# EAGLE design 4ch_relay (EAGLE 9.1.0)
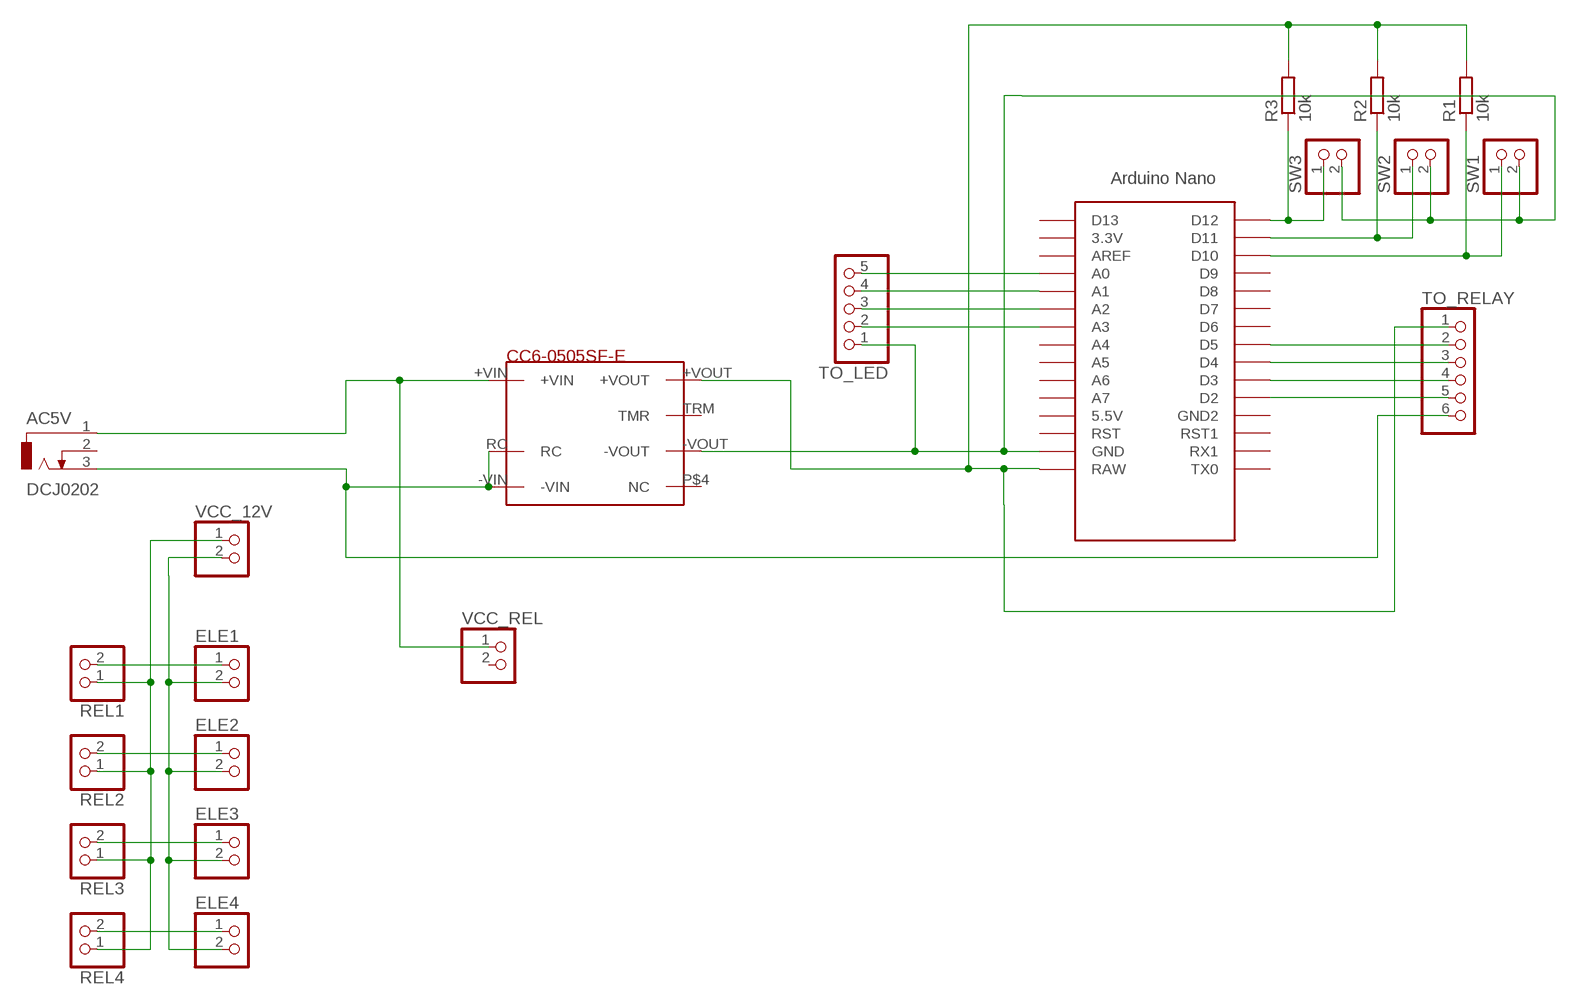
[diagram p0: schematic, sheet 1]

## Parts
AC5V  DCJ0202  [DCJ0202]
DC-DC1  DC-DC-CONVERTER  [DC_DC_CONVERTER]
ELE1  PINHD-1X2  [1X02]
ELE2  PINHD-1X2  [1X02]
ELE3  PINHD-1X2  [1X02]
ELE4  PINHD-1X2  [1X02]
R1  10k  R-EU_0207/10  [0207/10]
R2  10k  R-EU_0207/10  [0207/10]
R3  10k  R-EU_0207/10  [0207/10]
REL1  PINHD-1X2  [1X02]
REL2  PINHD-1X2  [1X02]
REL3  PINHD-1X2  [1X02]
REL4  PINHD-1X2  [1X02]
SW1  PINHD-1X2  [1X02]
SW2  PINHD-1X2  [1X02]
SW3  PINHD-1X2  [1X02]
TO_LED  PINHD-1X5  [1X05]
TO_RELAY  PINHD-1X6  [1X06]
U$1  NANO  [NANO]
VCC_12V  PINHD-1X2  [1X02]
VCC_REL  PINHD-1X2  [1X02]

## Nets
N$1: TO_LED.5 U$1.A0
N$2 [GND]: AC5V.1 DC-DC1.+VIN VCC_REL.1
N$3: TO_LED.4 U$1.A1
N$4: TO_LED.3 U$1.A2
N$5: TO_LED.2 U$1.A3
N$7: R3.1 SW3.1 U$1.D12
N$8: R2.1 SW2.1 U$1.D11
N$9: R1.1 SW1.1 U$1.D10
N$10: TO_RELAY.2 U$1.D5
N$11: TO_RELAY.3 U$1.D4
N$13: TO_RELAY.4 U$1.D3
N$14: TO_RELAY.5 U$1.D2
N$15: DC-DC1.+VOUT R1.2 R2.2 R3.2 TO_RELAY.1 U$1.RAW
N$17 [GND]: DC-DC1.-VOUT SW1.2 SW2.2 SW3.2 TO_LED.1 U$1.GND
N$18 [GND]: ELE1.1 REL1.2
N$19 [GND]: ELE2.1 REL2.2
N$20 [GND]: ELE3.1 REL3.2
N$21 [GND]: ELE4.1 REL4.2
N$23 [GND]: REL1.1 REL2.1 REL3.1 REL4.1 VCC_12V.1
N$25 [GND]: ELE1.2 ELE2.2 ELE3.2 ELE4.2 VCC_12V.2
N$30 [GND]: AC5V.3 DC-DC1.-VIN DC-DC1.RC TO_RELAY.6
Unconnected: AC5V.2 DC-DC1.P$4(NC) DC-DC1.TRM(TMR) U$1.3.3V U$1.5V(5.5V) U$1.A4 U$1.A5 U$1.A6 U$1.A7 U$1.AREF U$1.D6 U$1.D7 U$1.D8 U$1.D9 U$1.D13 U$1.GND1(GND2) U$1.ICSP1 U$1.ICSP2 U$1.ICSP3 U$1.ICSP4 U$1.ICSP5 U$1.ICSP6 U$1.RST U$1.RST1 U$1.RX1 U$1.TX0 VCC_REL.2

## Library data of the parts
AC5V = con-jack:DCJ0202: DC POWER JACK Source: DCJ0202.pdf; OC_FARNELL: unknown; OC_NEWARK: unknown
DC-DC1 = dc-dc-converter_CC6-0505SF-E:DC-DC-CONVERTER: dc-dc-converter CC6-0505SF-E マルツ 5VOUTPUT
ELE1-ELE4 REL1-REL4 SW1-SW3 VCC_12V VCC_REL = pinhead:PINHD-1X2: PIN HEADER
R1-R3 = rcl:R-EU_: RESISTOR, European symbol; SPICEPREFIX: R
TO_LED = pinhead:PINHD-1X5: PIN HEADER
TO_RELAY = pinhead:PINHD-1X6: PIN HEADER
U$1 = Arduino-clone:NANO: Arduino Nano

## Net classes
0 signal: width 0.4 mm, clearance 0.3 mm
1 GND: width 0.6 mm, clearance 0.4 mm

## Board
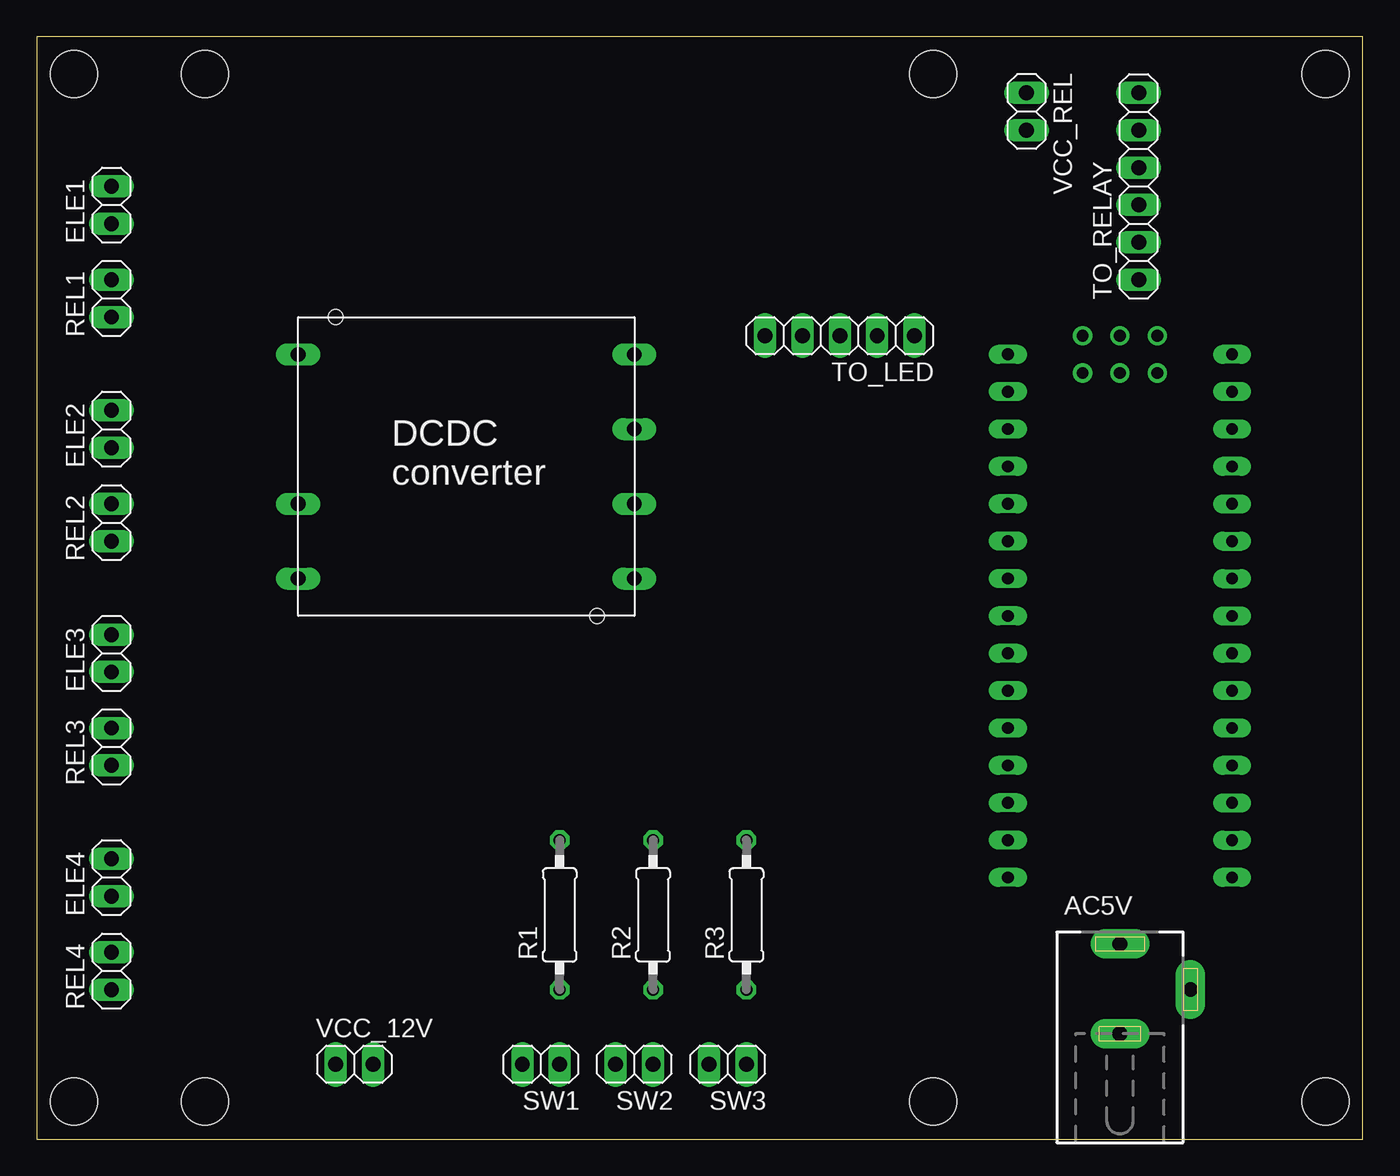
[diagram p1: board, top side]
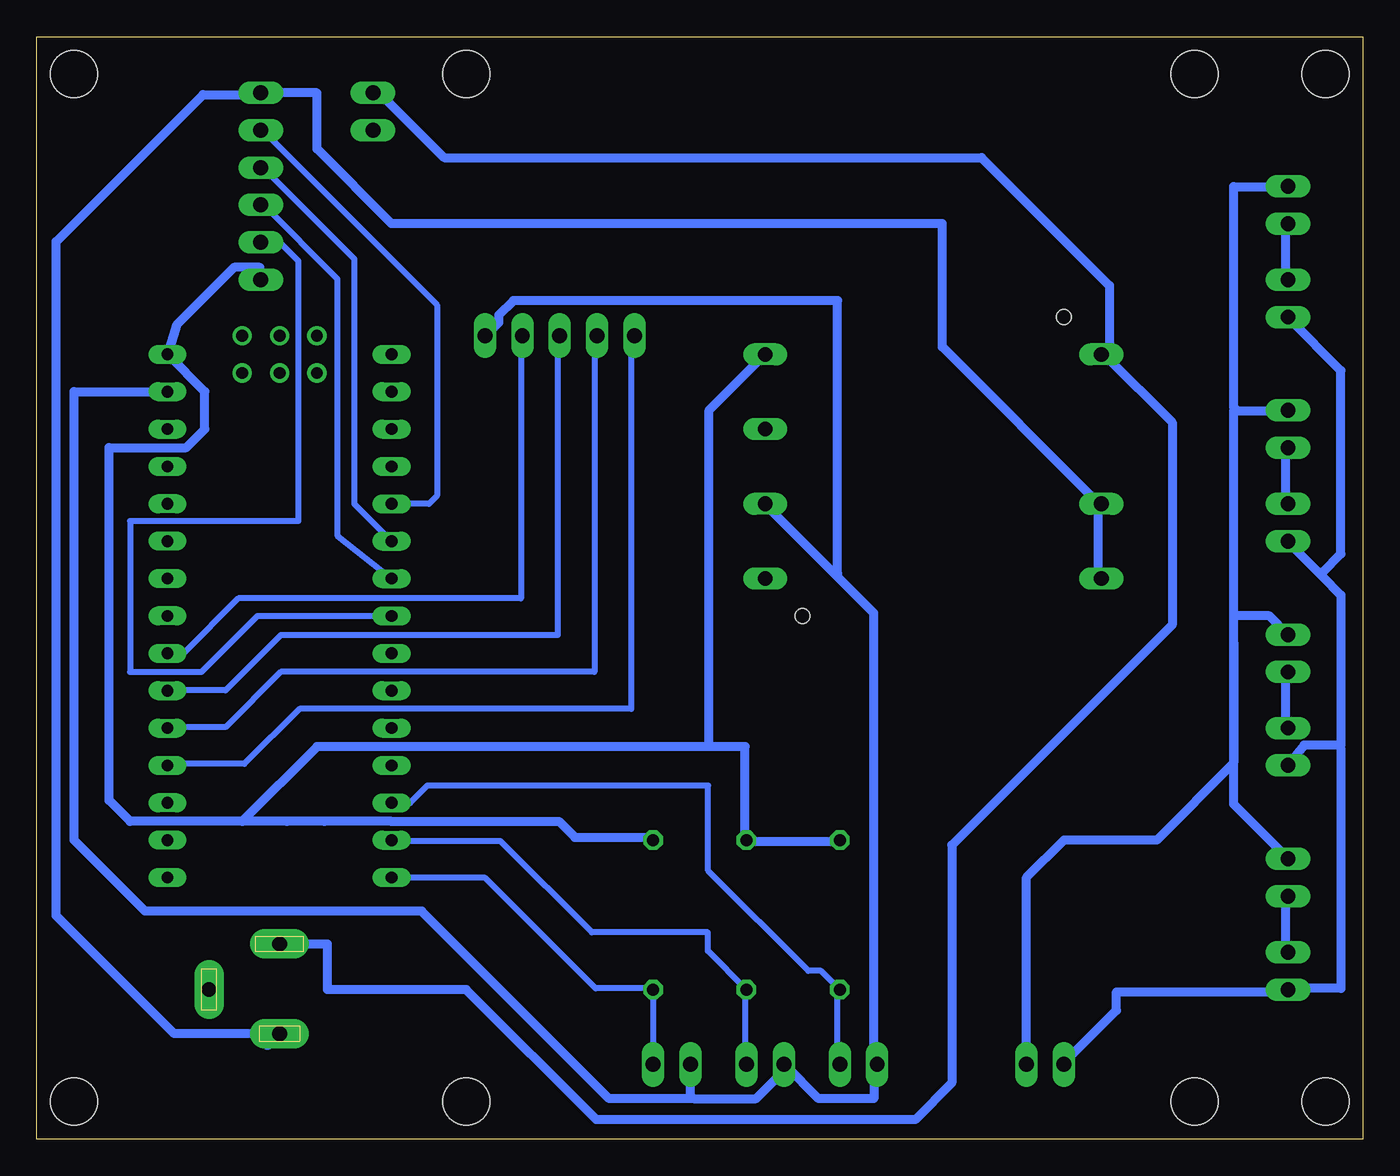
[diagram p2: board, bottom side, seen from below]

Size 90.17 x 74.93 mm. Coordinates in mm from the lower left corner, seen from the top.
Outline: 0,0 90.17,0 90.17,74.93 0,74.92 0,0
Copper layers (1*16): Top 0.035mm / dielectric 1.5mm / Bottom 0.035mm
Design rules "default": minimum track width 6mil, minimum drill 0.35mm, track to track 6mil, track to pad 6mil, pad to pad 6mil, via to via 6mil, smd to smd 6mil, copper to edge 40mil, drill to drill 6mil, minimum pad ring 10mil, minimum via ring 8mil, stop-mask expansion 4mil, vias tented up to drill 0mil, thermal gap 10mil
Holes 3.2 mm at 87.63,72.39 87.63,2.54 2.54,2.54 2.54,72.39 11.43,2.54 60.96,2.54 11.43,72.39 60.96,72.39

### Footprints (pad centres in the part's own frame; a part is rotated, then mirrored left to right if it is on the bottom)
DCJ0202 = drill 1 pad 2 long: 1 0,3.1; 2 4.8,0; 3 0,-3
DC_DC_CONVERTER = drill 1 long: +VIN -11.43,6.35; +VOUT 11.43,6.35; -VIN -11.43,-8.89; -VOUT 11.43,-3.81; P$4 11.43,-8.89; RC -11.43,-3.81; TRM 11.43,1.27 | hole 1: -8.89,8.89; 8.89,-11.43
1X02 = drill 1.016 long: 1 -1.27,0; 2 1.27,0
0207/10 = drill 0.813 octagon: 1 -5.08,0; 2 5.08,0
1X05 = drill 1.016 long: 1 -5.08,0; 2 -2.54,0; 3 0,0; 4 2.54,0; 5 5.08,0
1X06 = drill 1.016 long: 1 -6.35,0; 2 -3.81,0; 3 -1.27,0; 4 1.27,0; 5 3.81,0; 6 6.35,0
NANO = drill 0.8 long: 3.3V -10.16,24.13; 5V -10.16,-1.27; A0 -10.16,19.05; A1 -10.16,16.51; A2 -10.16,13.97; A3 -10.16,11.43; A4 -10.16,8.89; A5 -10.16,6.35; A6 -10.16,3.81; A7 -10.16,1.27; AREF -10.16,21.59; D2 5.08,1.27; D3 5.08,3.81; D4 5.08,6.35; D5 5.08,8.89; D6 5.08,11.43; D7 5.08,13.97; D8 5.08,16.51; D9 5.08,19.05; D10 5.08,21.59; D11 5.08,24.13; D12 5.08,26.67; D13 -10.16,26.67; GND -10.16,-6.35; GND1 5.08,-1.27; RAW -10.16,-8.89; RST -10.16,-3.81; RST1 5.08,-3.81; RX1 5.08,-6.35; TX0 5.08,-8.89 | drill 0.8: ICSP1 -5.08,-10.16; ICSP2 -5.08,-7.62; ICSP3 -2.54,-10.16; ICSP4 -2.54,-7.62; ICSP5 0,-10.16; ICSP6 0,-7.62

### Placement (x,y rotation side)
AC5V  73.66,10.16 0 top
DC-DC1  29.21,46.99 0 top
ELE1  5.08,63.5 90 top
ELE2  5.08,48.26 90 top
ELE3  5.08,33.02 90 top
ELE4  5.08,17.78 90 top
R1  35.56,15.24 90 top
R2  41.91,15.24 90 top
R3  48.26,15.24 90 top
REL1  5.08,57.15 90 top
REL2  5.08,41.91 90 top
REL3  5.08,26.67 90 top
REL4  5.08,11.43 90 top
SW1  34.29,5.08 180 top
SW2  40.64,5.08 180 top
SW3  46.99,5.08 180 top
TO_LED  54.61,54.61 180 top
TO_RELAY  74.93,64.77 90 top
U$1  71.12,44.45 180 top
VCC_12V  21.59,5.08 0 top
VCC_REL  67.31,69.85 270 top

### Tracks (layer width: path | path; a pad name or v marks a point on that pad's centre or on a via)
N$1
  Bottom 0.4: U$1.A0 81.23,25.5 76.06,25.5 72.31,29.25 49.75,29.25 49.75,54.5 TO_LED.5
N$2
  Bottom 0.6: VCC_REL.1 67.25,71 66.75,71 62.46,66.71 25.92,66.71 17.23,58.02 17.23,53.89 DC-DC1.+VIN 17.5,53.25 12.96,48.71 12.96,34.96 27.94,19.98 27.94,3.81 30.43,1.32 52.12,1.32 60.96,10.16 70.4,10.16 70.4,13.25 73.5,13.25 AC5V.1
N$3
  Bottom 0.4: U$1.A1 81.23,28 77.33,28 73.58,31.75 52.25,31.75 52.25,54.5 TO_LED.4
N$4
  Bottom 0.4: U$1.A2 81.23,30.5 77.33,30.5 73.58,34.25 54.75,34.25 54.75,54.5 TO_LED.3
N$5
  Bottom 0.4: TO_LED.2 57.25,54.5 57.25,36.75 76.46,36.75 80.19,33.02 U$1.A3
N$7
  Bottom 0.4: U$1.D12 65.98,17.75 59.67,17.75 52.17,10.25 48.5,10.25 R3.1 48.25,10 48.25,5.25 SW3.1
N$8
  Bottom 0.4: U$1.D11 65.98,20.25 58.63,20.25 52.42,14.04 44.54,14.04 44.54,12.79 R2.1 42,10 42,5.25 SW2.1
N$9
  Bottom 0.4: SW1.1 35.75,5.25 35.75,10 R1.1 36.83,11.43 37.7,11.43 44.52,18.25 44.52,24.02 63.61,24.02 64.77,22.86 U$1.D10
N$10
  Bottom 0.4: TO_RELAY.2 73.89,61.19 72.39,59.69 72.39,42 83.82,42 83.82,31.75 78.96,31.75 75.15,35.56 U$1.D5
N$11
  Bottom 0.4: U$1.D4 69.73,41.01 69.73,58.48 74.75,63.5 TO_RELAY.3
N$13
  Bottom 0.4: U$1.D3 68.58,43.18 68.58,59.83 74.75,66 TO_RELAY.4
N$14
  Bottom 0.4: TO_RELAY.5 74.75,68.5 62.96,56.71 62.96,43.72 63.5,43.18 U$1.D2
N$15
  Bottom 0.4: 35.75,20.25 R1.2 | 41.75,20.25 R2.2 42,20.5 | 48.5,20.5 R3.2 | 40.75,53.25 DC-DC1.+VOUT | 81.23,53.25 U$1.RAW
  Bottom 0.6: TO_RELAY.1 75,58.5 75,59.25 76.75,59.25 80.65,55.35 U$1.RAW 78.74,50.8 78.74,48.26 80,47 85.25,47 85.25,23.02 83.82,21.59 76.2,21.59 | 41.75,20.25 35.75,20.25 | 48.5,20.5 53.57,20.5 54.66,21.59 66.04,21.59 70.61,21.59 73.15,21.59 76.2,21.59 | 76.2,21.59 71.12,26.67 44.45,26.67 | 42,20.5 42,26.67 43.18,26.67 44.45,26.67 | 40.75,53.25 44.45,49.55 44.45,26.67
N$17
  Bottom 0.6: 35.84,38.34 38.38,40.88 40.5,43 DC-DC1.-VOUT | TO_LED.1 59.5,54.75 58.75,55.5 58.75,56 57.75,57 35.71,57 35.71,38.46 35.84,38.34 | U$1.GND 87.63,50.8 87.63,20.32 82.81,15.5 64,15.5 51.25,2.75 45.75,2.75 | 45.75,2.75 45.75,5 SW3.2 | 45.75,2.75 45.5,2.75 41.25,2.75 39.25,4.75 SW2.2 39.25,5 37,2.75 33.25,2.75 33.25,5 SW1.2 33.25,5.25 33.25,35.75 35.84,38.34
N$18
  Bottom 0.6: REL1.2 5.25,58.5 5.25,62 ELE1.1
N$19
  Bottom 0.6: REL2.2 5.25,43.25 5.25,46.75 ELE2.1
N$20
  Bottom 0.6: REL3.2 5.25,28 5.25,31.75 ELE3.1
N$21
  Bottom 0.6: REL4.2 5.25,12.75 5.25,16.5 ELE4.1
N$23
  Bottom 0.6: VCC_12V.1 20.25,5.25 16.75,8.75 16.75,10 5.25,10 REL4.1 5,10.25 1.48,10.25 1.48,26.52 1.48,26.77 | 1.48,26.77 3.98,26.77 REL3.1 | 1.48,26.77 1.48,36.98 2.75,38.25 | 2.75,38.25 5,40.5 REL2.1 | REL1.1 5,55.75 1.48,52.23 1.48,39.77 2.75,38.5 2.75,38.25
N$25
  Bottom 0.6: 7.12,21.12 6.97,20.97 | 6.97,20.97 5.25,19.25 ELE4.2 | 8.52,49.5 8.77,49.5 8.77,35.56 | 8.77,33.77 8.77,35.56 | ELE2.2 5.25,49.5 7.5,49.5 8.52,49.5 | 8.77,33.77 8.77,32.88 | ELE1.2 5.25,64.75 8.77,64.75 8.77,49.75 8.52,49.5 | VCC_12V.2 22.86,17.78 20.32,20.32 14.02,20.32 8.77,25.57 8.77,33.77 | 6.97,20.97 8.77,22.77 8.77,33.77 | ELE3.2 6.35,35.56 8.77,35.56
N$30
  Bottom 0.6: DC-DC1.-VIN 18,38.25 18,43 DC-DC1.RC 18,43.25 28.6,53.85 28.6,62.23 66.04,62.23 71.12,67.31 71.12,71.12 TO_RELAY.6 75,71 78.86,71 88.85,61.01 88.85,15.19 80.82,7.16 AC5V.3 74.47,6.35